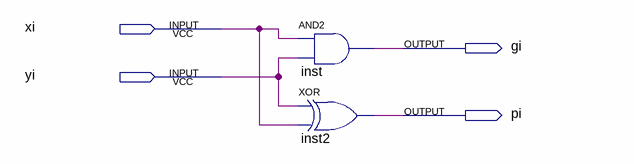
[diagram p0: schematic sheet]
// Quartus schematic meio_somador.bdf as structural Verilog: 2 symbols, 4 pins
module meio_somador (
  input  xi,
  input  yi,
  output gi,
  output pi
);

  and inst (gi, xi, yi);
  xor inst2 (pi, yi, xi);
endmodule
